# EAGLE design I-GAUGE WEMOS (EAGLE 6.5.0)
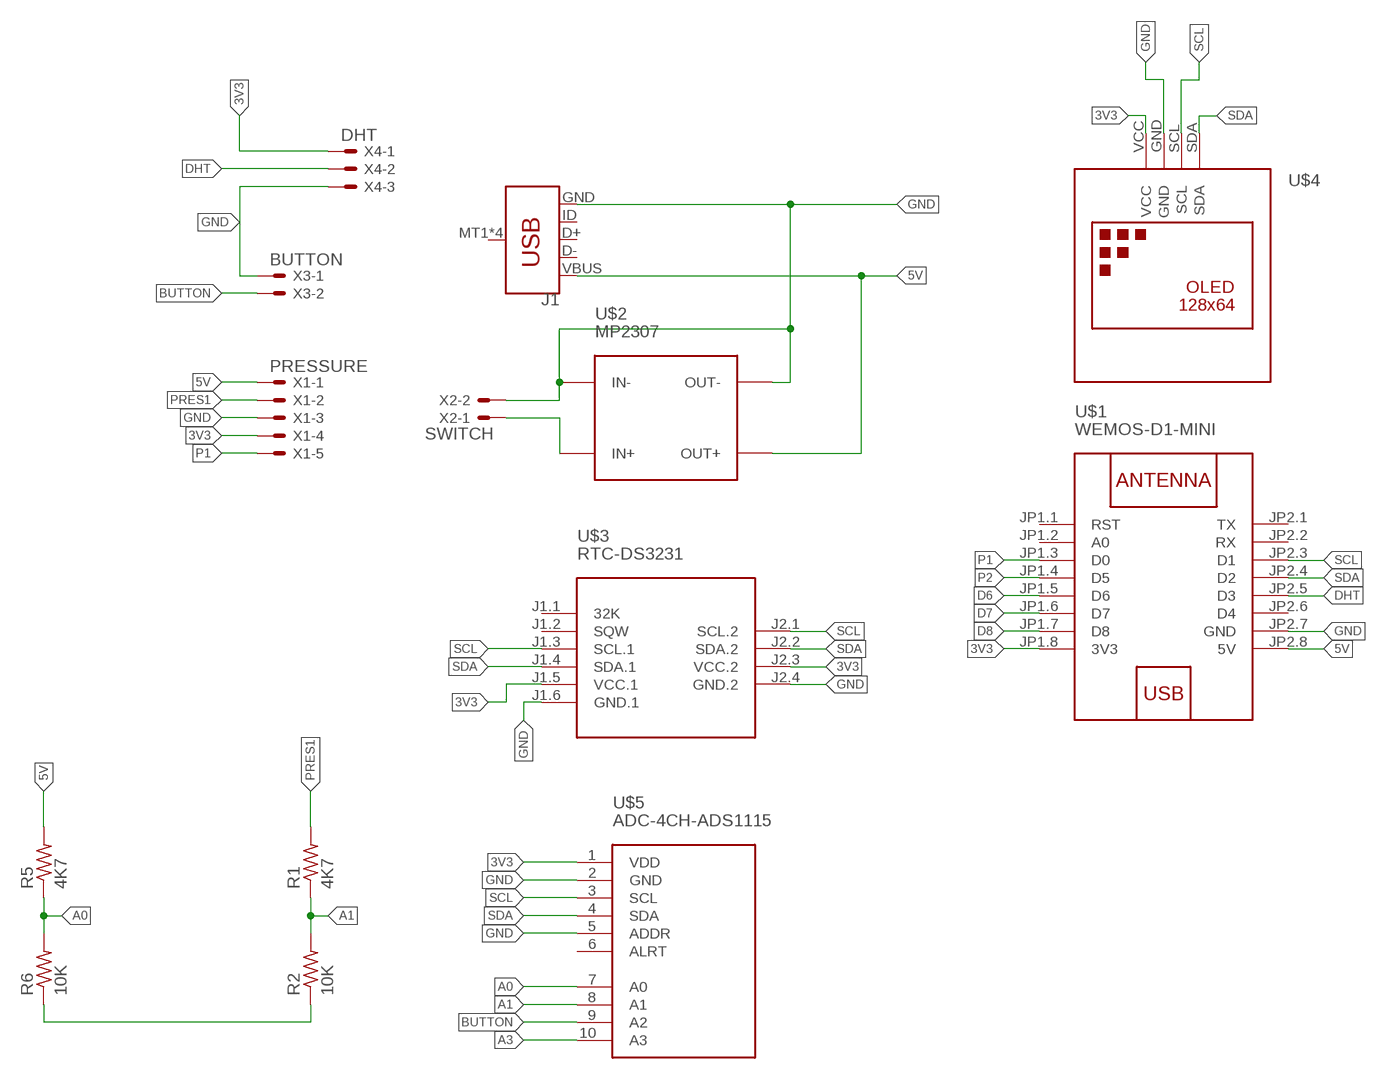
[diagram p0: schematic, sheet 1]

## Parts
J1  USB_MICRO-B_SMT  [USB-MICROB]
R1  4K7  R-US_R1210  [R1210]
R2  10K  R-US_R1210  [R1210]
R5  4K7  R-US_R1210  [R1210]
R6  10K  R-US_R1210  [R1210]
U$1  WEMOS-D1-MINI  [WEMOS-D1-MINI]
U$2  MP2307  DC-DC-STEP-DOWN-MP2307  [DC-DC-STEP-DOWN-MP2307]
U$3  RTC-DS3231  RTC-DS3231-AT24C32  [RTC-DS3231-AT24C32]
U$4  DISPLAY-OLED-128X64-I2C  [DISPLAY-OLED-128X64-I2C]
U$5  ADC-4CH-ADS1115  [ADC-4CH-ADS1115]
X1  PRESSURE  JST-XH-05-PIN-LONG-PAD  [JST-XH-05-PACKAGE-LONG-PAD]
X2  SWITCH  JST-XH-02-PIN-LONG-PAD  [JST-XH-02-PACKAGE-LONG-PAD]
X3  BUTTON  JST-XH-02-PIN-LONG-PAD  [JST-XH-02-PACKAGE-LONG-PAD]
X4  DHT  JST-XH-03-PIN-LONG-PAD  [JST-XH-03-PACKAGE-LONG-PAD]

## Nets
3V3: U$1.JP1.8(3V3) U$3.J1.5(VCC.1) U$3.J2.3(VCC.2) U$4.VCC U$5.1(VDD) X1.4 X4.1
5V: J1.VBUS R5.2 U$1.JP2.8(5V) U$2.OUT+ X1.1
A0: R5.1 R6.2 U$5.7(A0)
A1: R1.1 R2.2 U$5.8(A1)
A3: U$5.10(A3)
BUTTON: U$5.9(A2) X3.2
D6: U$1.JP1.5(D6)
D7: U$1.JP1.6(D7)
D8: U$1.JP1.7(D8)
DHT: U$1.JP2.5(D3) X4.2
GND: J1.GND R2.1 R6.1 U$1.JP2.7(GND) U$2.IN- U$2.OUT- U$3.J1.6(GND.1) U$3.J2.4(GND.2) U$4.GND U$5.2(GND) U$5.5(ADDR) X1.3 X2.2 X3.1 X4.3
N$2: U$2.IN+ X2.1
P1: U$1.JP1.3(D0) X1.5
P2: U$1.JP1.4(D5)
PRES1: R1.2 X1.2
SCL: U$1.JP2.3(D1) U$3.J1.3(SCL.1) U$3.J2.1(SCL.2) U$4.SCL U$5.3(SCL)
SDA: U$1.JP2.4(D2) U$3.J1.4(SDA.1) U$3.J2.2(SDA.2) U$4.SDA U$5.4(SDA)
Unconnected: J1.D+ J1.D- J1.ID J1.MT1(SHIELD) J1.MT2(SHIELD) J1.P$1(SHIELD) J1.P$2(SHIELD) U$1.JP1.1(RST) U$1.JP1.2(A0) U$1.JP2.1(TX) U$1.JP2.2(RX) U$1.JP2.6(D4) U$3.J1.1(32K) U$3.J1.2(SQW) U$5.6(ALRT)

## Library data of the parts
J1 = SparkFun-Connectors:USB_MICRO-B: USB Type Micro-B Connector Male/female and PTH/SMT variants SparkFun Products: SparkFun microB USB Breakout <https://www.sparkfun.com/products/12035> SparkFun USB microB Plug Breakout <https://www.sparkfun.com/products/10031> SparkFun ESP8266 Thing <https://www.sparkfun.com/products/13231>; PROD_ID: CONN-09505; SF_ID: PRT-08533
R1 R2 R5 R6 = resistor:R-US_: RESISTOR, American symbol
U$1 = diy-modules:WEMOS-D1-MINI: WEMOS D1 mini: Mini Wi-Fi Board based on ESP-8266 device More details can be found here: https://www.wemos.cc/product/d1-mini.html Click here to find device on ebay.com <http://www.ebay.com/sch/wemos+d1+mini+nodemcu>
U$2 = diy-modules:DC-DC-STEP-DOWN-MP2307: DC/DC Step-Down Regulator based on MP2307DN chip MP2307 datasheet available here: https://cdn-shop.adafruit.com/datasheets/MP2307_r1.9.pdf Click here to find device on ebay.com <http://www.ebay.com/sch/dc+dc+3a+mini+converter>
U$3 = diy-modules:RTC-DS3231-AT24C32: RTC Module with Battery and EEPROM based on DS3231 and AT24C32 chips Tutorial can be found here: https://edwardmallon.wordpress.com/2014/05/21/using-a-cheap-3-ds3231-rtc-at24c32-eeprom-from-ebay/ Click here to find device on ebay.com <http://www.ebay.com/sch/DS3231+AT24C32+module>
U$4 = diy-modules:DISPLAY-OLED-128X64-I2C: 128x64 Dot Matrix OLED Module based on SSD1306 chip Variant with I2C interface More details available here: http://www.instructables.com/id/Monochrome-096-i2c-OLED-display-with-arduino-SSD13/ SSD1306 datasheet: https://cdn-shop.adafruit.com/datasheets/SSD1306.pdf Click here to find device on ebay.com <http://www.ebay.com/sch/oled+display+128x64+iic> Note: There are two variants: I2C and SPI. Search for the proper version.
U$5 = diy-modules:ADC-4CH-ADS1115: 4 Channel 16-Bit Analog-to-Digital Converter based on ADS1115 chip Arduino ADS1115 Getting Started Tutorial is available here: http://henrysbench.capnfatz.com/henrys-bench/arduino-voltage-measurements/arduino-ads1115-module-getting-started-tutorial/ ADS1115 datasheet is available here: http://www.ti.com/lit/ds/symlink/ads1115.pdf Click here to find device on ebay.com <http://www.ebay.com/sch/ads1115+module>
X1 = jst XH:JST-XH-05-PIN: JST XH Connector 2 Pin Wire to board connector. Pitch: 2,54 mm, (0.100") Number of pins: 5 Created by Rembrandt Electronics www.rembrandtelectronics.com
X2 X3 = jst XH:JST-XH-02-PIN: JST XH Connector 2 Pin Wire to board connector. Pitch: 2,54 mm, (0.100") Number of pins: 2 Created by Rembrandt Electronics www.rembrandtelectronics.com
X4 = jst XH:JST-XH-03-PIN: JST XH Connector 2 Pin Wire to board connector. Pitch: 2,54 mm, (0.100") Number of pins: 3 Created by Rembrandt Electronics www.rembrandtelectronics.com

## Board
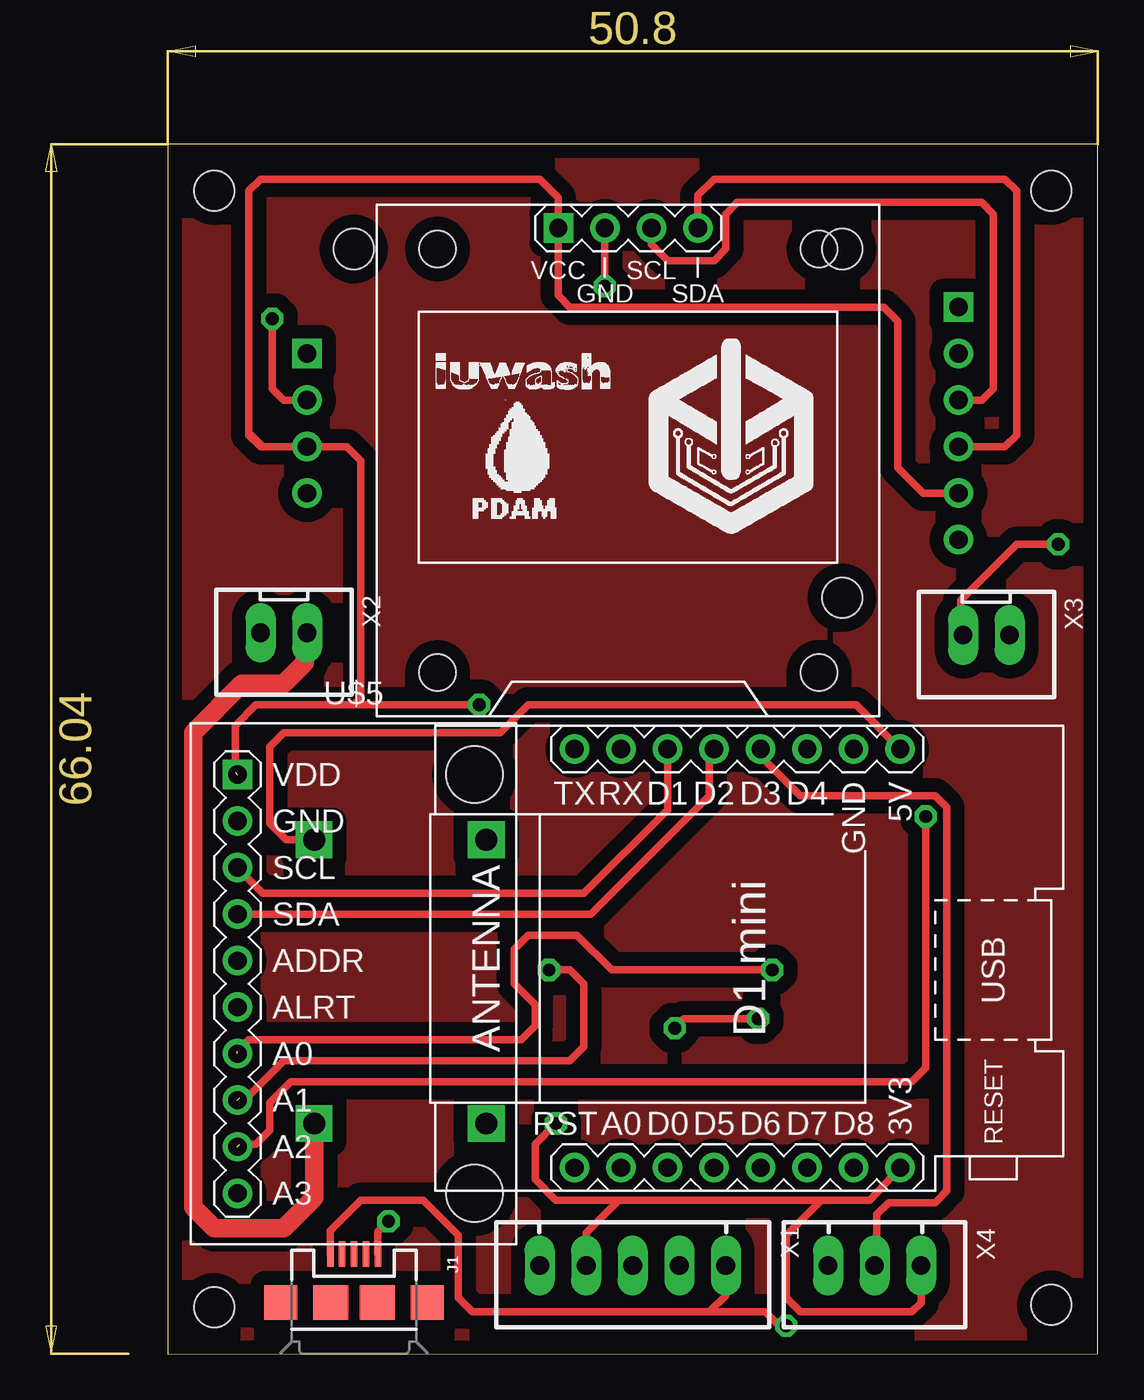
[diagram p1: board, top side]
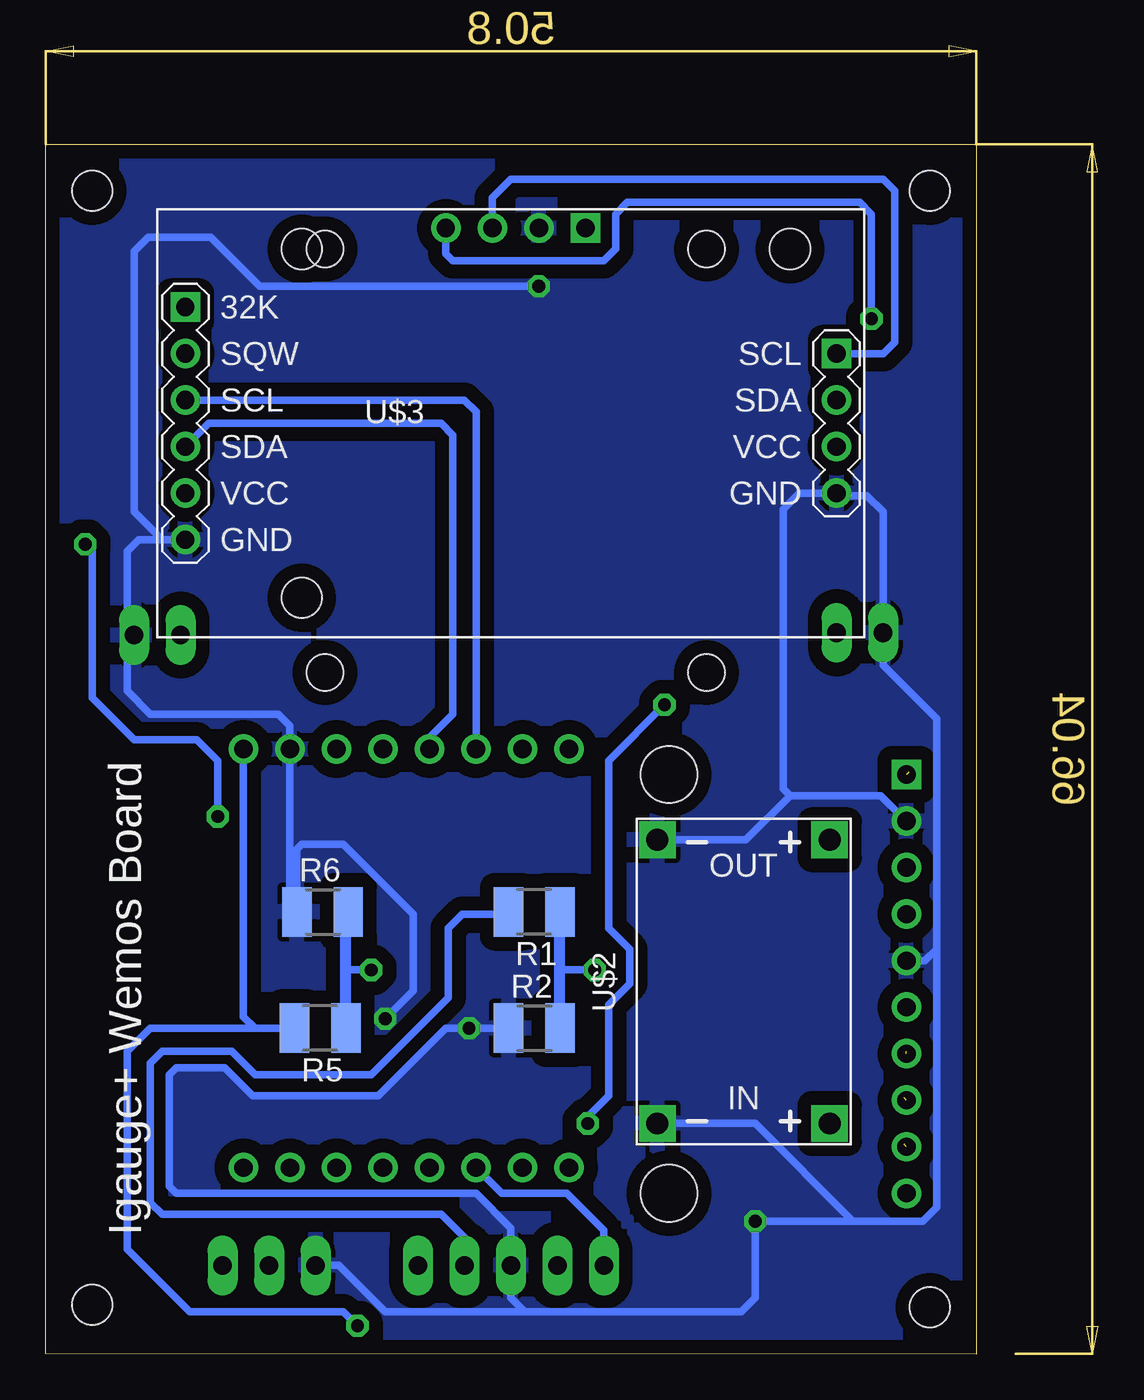
[diagram p2: board, bottom side, seen from below]

Size 50.8 x 66.06 mm. Coordinates in mm from the lower left corner, seen from the top.
Outline: 0,0 50.8,0.03 50.8,66.06 0,66.06 0,0
Copper layers (1*16): Top 0.035mm / dielectric 1.5mm / Bottom 0.035mm
Design rules "SparkFun *": minimum track width 8mil, minimum drill 20mil, track to track 30mil, track to pad 30mil, pad to pad 30mil, via to via 30mil, smd to smd 30mil, copper to edge 30mil, drill to drill 30mil, minimum pad ring 12mil, minimum via ring 10mil, stop-mask expansion 4mil, vias tented up to drill 20mil, thermal gap 10mil
Holes 2.2 mm at 2.54,63.52 48.26,63.52 48.26,2.69 2.54,2.57

### Footprints (pad centres in the part's own frame; a part is rotated, then mirrored left to right if it is on the bottom)
USB-MICROB = smd 1.4 x 0.35: D+ -2.65,0; D- -2.65,-0.65; GND -2.65,1.3; ID -2.65,0.65; VBUS -2.65,-1.3 | smd 1.9 x 1.8: MT1 0,-4; MT2 0,4 | smd 1.9 x 1.9: P$1 0,-1.27; P$2 0,1.27
R1210 = smd 1.6 x 2.7: 1 -1.4,0; 2 1.4,0
WEMOS-D1-MINI = drill 1: JP1.1 -11.43,9.525; JP1.2 -11.43,6.985; JP1.3 -11.43,4.445; JP1.4 -11.43,1.905; JP1.5 -11.43,-0.635; JP1.6 -11.43,-3.175; JP1.7 -11.43,-5.715; JP1.8 -11.43,-8.255; JP2.1 11.43,9.525; JP2.2 11.43,6.985; JP2.3 11.43,4.445; JP2.4 11.43,1.905; JP2.5 11.43,-0.635; JP2.6 11.43,-3.175; JP2.7 11.43,-5.715; JP2.8 11.43,-8.255
DC-DC-STEP-DOWN-MP2307 = drill 1.2 pad 2 square: IN+ -7.747,-4.699; IN- -7.747,4.699; OUT+ 7.747,-4.699; OUT- 7.747,4.699
RTC-DS3231-AT24C32 = drill 1 square: J1.1 -17.78,6.35; J2.1 17.78,3.81 | drill 1: J1.2 -17.78,3.81; J1.3 -17.78,1.27; J1.4 -17.78,-1.27; J1.5 -17.78,-3.81; J1.6 -17.78,-6.35; J2.2 17.78,1.27; J2.3 17.78,-1.27; J2.4 17.78,-3.81 | hole 2.2: -11.43,-9.525; -11.43,9.525; 15.24,9.525
DISPLAY-OLED-128X64-I2C = drill 1: GND -1.27,12.7; SCL 1.27,12.7; SDA 3.81,12.7 | drill 1 square: VCC -3.81,12.7 | hole 2: -10.414,11.557; 10.414,11.557; 10.414,-11.557; -10.414,-11.557
ADC-4CH-ADS1115 = drill 1 square: 1 -6.35,11.43 | drill 1: 2 -6.35,8.89; 3 -6.35,6.35; 4 -6.35,3.81; 5 -6.35,1.27; 6 -6.35,-1.27; 7 -6.35,-3.81; 8 -6.35,-6.35; 9 -6.35,-8.89; 10 -6.35,-11.43 | hole 3.1: 6.604,11.43; 6.604,-11.43
JST-XH-05-PACKAGE-LONG-PAD = drill 1.016 long: 1 -5.08,0; 2 -2.54,0; 3 0,0; 4 2.54,0; 5 5.08,0
JST-XH-02-PACKAGE-LONG-PAD = drill 1.016 long: 1 -1.27,0; 2 1.27,0
JST-XH-03-PACKAGE-LONG-PAD = drill 1.016 long: 1 -2.54,0; 2 0,0; 3 2.54,0

### Placement (x,y rotation side)
J1  10.19,2.82 270 top
R1  24.13,24.15 180 bottom
R2  24.13,17.81 0 bottom
R5  35.81,17.81 180 bottom
R6  35.69,24.15 0 bottom
U$1  31.75,21.61 90 top
U$2  12.7,20.35 90 bottom
U$3  25.4,50.83 0 bottom
U$4  25.15,48.79 0 top
U$5  10.16,20.22 0 top
X1  25.4,4.85 180 top
X2  6.35,39.39 180 top
X3  44.7,39.27 180 top
X4  38.61,4.85 180 top

### Tracks (layer width: path | path; a pad name or v marks a point on that pad's centre or on a via)
3V3  (via drill 0.7)  (1 unrouted)
  Top 0.406: 4.45,50.32 4.45,63.52 5.08,64.16 20.32,64.16 21.34,63.14 U$4.VCC 21.34,57.81 21.97,57.17 39.12,57.17 39.88,56.41 39.88,48.41 41.27,47.02 U$3.J1.5 | 4.45,50.32 4.45,50.19 5.08,49.55 U$3.J2.3 | U$1.JP1.8 38.35,8.41 35.69,8.41 | 35.69,8.41 24.64,8.41 | U$3.J2.3 5.21,49.55 4.45,50.32 | X1.4 22.86,6.63 24.64,8.41 | 24.64,8.41 21.21,8.41 20.07,9.55 20.07,11.46 v21.21,12.6 | 3.68,31.78 3.68,34.31 4.83,35.46 10.16,35.46 | U$3.J2.3 9.78,49.55 10.54,48.79 10.54,35.84 10.16,35.46 | v17.02,35.46 10.16,35.46 | X4.1 41.15,2.82 40.64,2.31 34.54,2.31 33.78,3.07 33.78,6.5 35.69,8.41
  Bottom 0.406: v21.21,12.6 21.21,12.98 20.07,14.12 20.07,19.07 18.92,20.22 18.92,22.12 20.07,23.27 20.07,32.41 v17.02,35.46
5V  (via drill 0.7)
  Top 0.406: X1.1 30.48,3.2 29.59,2.31 | J1.VBUS 8.88,6.75 10.54,8.41 13.97,8.41 15.88,6.5 15.88,3.07 16.64,2.31 29.21,2.31 29.59,2.31 | U$2.OUT+ 6.48,28.09 5.59,28.98 5.59,33.17 6.35,33.93 18.16,33.93 19.68,35.46 37.59,35.46 U$1.JP2.8 | v33.78,1.55 33.4,1.55 32.64,2.31 29.59,2.31
  Bottom 0.406: U$1.JP2.8 40.01,18.44 39.37,17.81 | R5.2 39.37,17.81 | 39.37,17.81 45.09,17.81 46.35,16.54 46.35,5.74 42.93,2.31 34.54,2.31 v33.78,1.55
A0  (via drill 0.7)  (1 unrouted)
  Top 0.406: v33.02,20.98 24.26,20.98 22.35,22.89 19.68,22.89 18.92,22.12 18.92,20.22 20.07,19.07 20.07,17.93 19.3,17.17 4.45,17.17 3.81,16.54
  Bottom 0.406: v33.02,20.98 34.41,20.98
  Bottom 0.61: R5.1 34.41,20.98 34.41,24.03 R6.2
A1  (via drill 0.7)  (1 unrouted)
  Top 0.406: v20.83,20.98 21.97,20.98 22.73,20.22 22.73,16.79 21.97,16.03 6.35,16.03 4.32,14 3.94,14
  Bottom 0.406: v20.83,20.98 22.73,20.98
  Bottom 0.61: R2.2 22.73,20.98 R1.1
BUTTON  (via drill 0.7)  (1 unrouted)
  Top 0.406: v41.4,29.36 41.4,15.65 40.64,14.88 6.73,14.88 5.59,13.74 5.59,12.22 4.83,11.46 3.94,11.46 | v48.64,44.22 46.35,44.22 43.31,41.17 43.31,39.78 X3.2
  Bottom 0.406: v41.4,29.36 41.4,32.41 42.55,33.55 45.97,33.55 48.26,35.84 48.26,43.84 v48.64,44.22
DHT
  Top 0.406: X4.2 38.73,4.98 38.73,7.64 39.37,8.28 41.91,8.28 42.55,8.91 42.55,29.87 41.91,30.5 34.54,30.5 32.64,32.41 32.64,32.79 U$1.JP2.5
GND  (via drill 0.7)
  Top 0.406: J1.GND 11.48,6.68 v12.07,7.26 | U$4.GND v23.88,58.32 | v32.26,18.31 28.19,18.31 v27.69,17.81
  Bottom 0.406: U$3.J1.6 44.45,44.47 | 44.45,44.47 45.72,44.47 46.35,43.84 46.35,40.03 X3.1 46.35,39.27 46.35,36.22 45.09,34.95 38.1,34.95 37.46,34.31 U$1.JP2.7 37.46,24.53 R6.1 37.09,27.58 36.83,27.84 34.54,27.84 30.73,24.03 30.73,19.84 v32.26,18.31 | 24.64,2.31 12.83,2.31 12.07,3.07 v12.07,7.26 6.73,7.26 | 24.64,2.31 25.4,3.07 X1.3 25.4,6.88 27.3,8.79 43.69,8.79 44.07,9.17 44.07,15.27 43.69,15.65 41.02,15.65 39.5,14.12 32.64,14.12 28.96,17.81 v27.69,17.81 R2.1 | 10.16,30.5 5.21,30.5 U$5.2 | 10.16,30.5 10.54,30.89 10.54,46.13 9.65,47.02 U$3.J2.4 7.49,46.89 5.97,46.89 5.08,46 X2.2 5.08,37.62 2.16,34.7 2.16,22.12 | 44.45,44.47 45.97,46 45.97,60.22 45.21,60.98 41.78,60.98 39.12,58.32 v23.88,58.32 | 2.16,22.12 2.16,8.03 2.92,7.26 6.73,7.26 | 6.73,7.26 12.07,12.6 U$2.IN- | X4.3 34.8,4.85 32.26,2.31 24.64,2.31 | U$5.5 2.79,21.49 2.16,22.12 | U$2.OUT- 12.57,28.09 10.16,30.5
  pour Bottom: 0,66.06 50.8,66.06 50.8,0.03 0,0.03
N$2
  Top 0.406: 2.16,34.7 4.06,36.6 | 7.87,39.14 X2.1
  Top 1.016: U$2.IN+ 8,8.53 6.35,6.88 2.54,6.88 1.4,8.03 1.4,33.93 4.06,36.6 6.35,36.6 7.49,37.74 7.49,39.27 X2.1
N$3
  pour Top: 0,66.06 50.8,66.06 50.8,0.03 0,0.03
P1
  Bottom 0.406: U$1.JP1.3 25.91,8.79 22.35,8.79 20.32,6.76 X1.5
PRES1
  Bottom 0.406: X1.2 27.94,6.38 29.21,7.64 44.45,7.64 45.09,8.28 45.09,15.9 44.45,16.54 40.64,16.54 39.37,15.27 33.02,15.27 28.83,19.46 28.83,23.27 28.07,24.03 25.66,24.03 R1.2
SCL
  Top 0.406: U$4.SCL 26.42,60.6 27.3,59.72 29.84,59.72 30.48,60.35 30.48,62.25 31.11,62.89 44.45,62.89 45.09,62.25 45.09,52.73 44.45,52.09 U$3.J1.3 | 27.3,32.79 U$1.JP2.3 27.3,29.74 22.73,25.17 5.21,25.17 U$5.3
  Bottom 0.406: U$4.SCL 26.42,63.14 25.4,64.16 5.08,64.16 4.45,63.52 4.45,55.27 5.08,54.63 U$3.J2.1 | U$1.JP2.3 27.3,51.46 27.94,52.09 U$3.J1.3
SDA  (via drill 0.7)
  Top 0.406: U$4.SDA 28.96,63.27 29.84,64.16 45.72,64.16 46.35,63.52 46.35,50.19 45.72,49.55 U$3.J1.4 | v5.71,56.54 5.71,52.73 6.35,52.09 U$3.J2.2 | U$5.4 23.11,24.03 29.59,30.5 29.59,32.79 U$1.JP2.4
  Bottom 0.406: U$4.SDA 28.96,60.1 28.57,59.72 20.32,59.72 19.68,60.35 19.68,62.25 19.05,62.89 6.35,62.89 5.71,62.25 v5.71,56.54 | U$1.JP2.4 29.84,33.68 28.57,34.95 28.57,50.19 29.21,50.83 41.91,50.83 U$3.J1.4

### Text on the board
bNames: Igauge+ Wemos Board